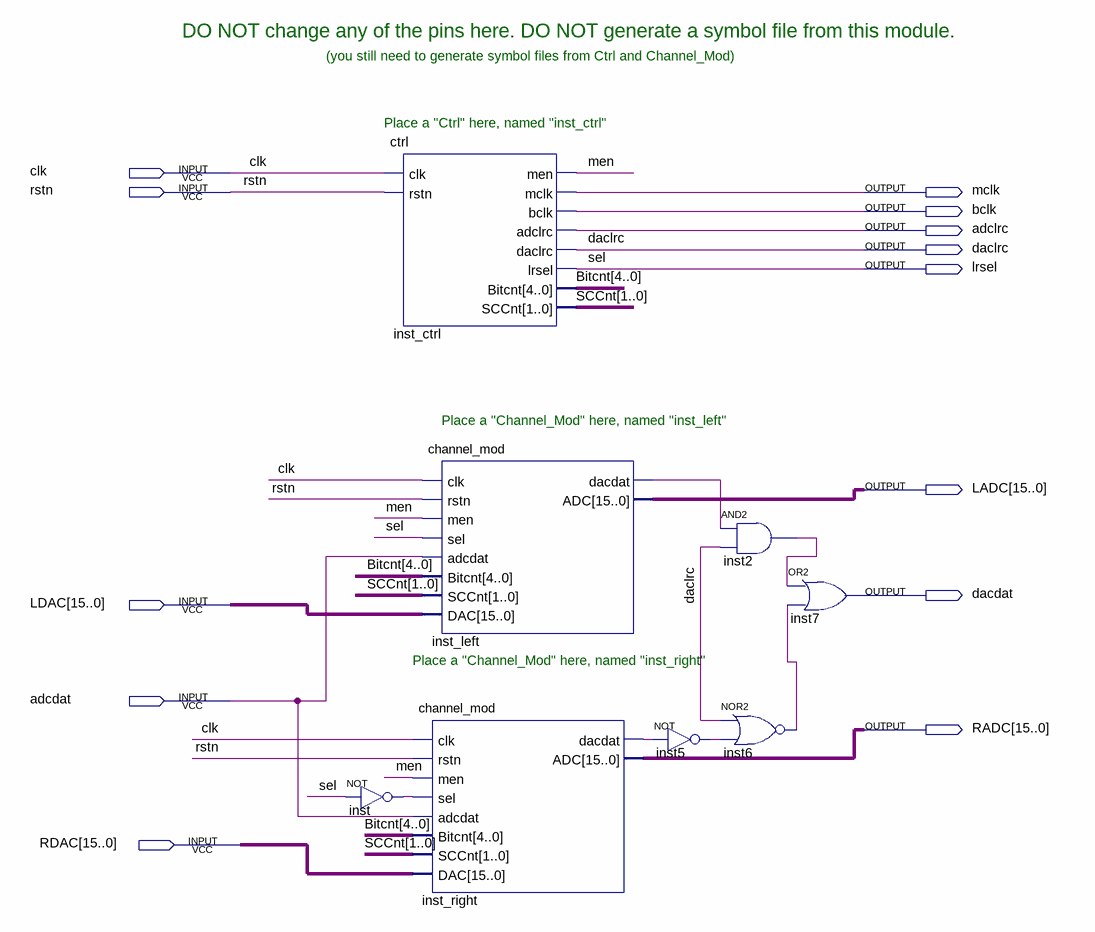
[diagram p0: schematic sheet]
// Quartus schematic SndDriver.bdf as structural Verilog: 8 symbols, 13 pins
module SndDriver (
  input  clk,
  input  rstn,
  input  [15:0] LDAC,
  input  adcdat,
  input  [15:0] RDAC,
  output mclk,
  output bclk,
  output adclrc,
  output daclrc,
  output lrsel,
  output [15:0] LADC,
  output dacdat,
  output [15:0] RADC
);

  wire inst2_out, inst5_out, inst6_out, inst_left_dacdat, inst_out, inst_right_dacdat, men;
  wire [1:0] SCCnt;
  wire [4:0] Bitcnt;

  not inst (inst_out, lrsel);
  ctrl inst_ctrl (
    .clk(clk), .rstn(rstn), .men(men), .mclk(mclk), .bclk(bclk), .adclrc(adclrc), .daclrc(daclrc),
    .lrsel(lrsel), .Bitcnt(Bitcnt), .SCCnt(SCCnt));
  channel_mod inst_left (
    .clk(clk), .rstn(rstn), .men(men), .sel(lrsel), .adcdat(adcdat), .Bitcnt(Bitcnt), .SCCnt(SCCnt),
    .DAC(LDAC), .dacdat(inst_left_dacdat), .ADC(LADC));
  channel_mod inst_right (
    .clk(clk), .rstn(rstn), .men(men), .sel(inst_out), .adcdat(adcdat), .Bitcnt(Bitcnt), .SCCnt(SCCnt),
    .DAC(RDAC), .dacdat(inst_right_dacdat), .ADC(RADC));
  not inst5 (inst5_out, inst_right_dacdat);
  and inst2 (inst2_out, inst_left_dacdat, daclrc);
  nor inst6 (inst6_out, daclrc, inst5_out);
  or inst7 (dacdat, inst2_out, inst6_out);

  // Other names for the same wires on the sheet: sel = lrsel

  // Notes on the sheet:
  //   DO NOT change any of the pins here. DO NOT generate a symbol file from this module.
  //   (you still need to generate symbol files from Ctrl and Channel_Mod)
  //   Place a "Ctrl" here, named "inst_ctrl"
  //   Place a "Channel_Mod" here, named "inst_left"
  //   Place a "Channel_Mod" here, named "inst_right"
endmodule
